# EAGLE design non_inverting_amplifier_2 (EAGLE 9.3.2)
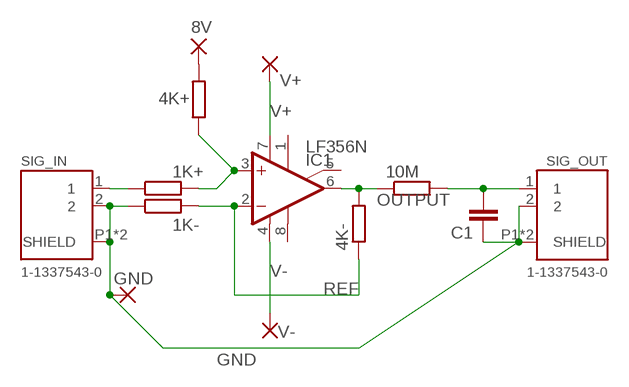
[diagram p0: schematic, sheet 1]

## Parts
1K+  R-EU_0207/12  [0207/12]
1K-  R-EU_0207/12  [0207/12]
4K+  R-EU_0207/12  [0207/12]
4K-  R-EU_0207/12  [0207/12]
8V  2,54/1,1  [2,54/1,1]
10M  R-EU_0207/12  [0207/12]
C1  C2,5-3  [C2.5-3]
GND  2,54/1,1  [2,54/1,1]
IC1  LF356N  [DIL08]
SIG_IN  1-1337543-0  [CONN_1-1337543-0]
SIG_OUT  1-1337543-0  [CONN_1-1337543-0]
V+  2,54/1,1  [2,54/1,1]
V-  2,54/1,1  [2,54/1,1]

## Nets
GND: 1K-.1 C1.1 GND.1(P) SIG_IN.2 SIG_IN.P1(SHIELD) SIG_IN.P2(SHIELD) SIG_OUT.2 SIG_OUT.P1(SHIELD) SIG_OUT.P2(SHIELD)
N$1: 1K+.1 SIG_IN.1
N$2: 1K+.2 4K+.1 IC1.3(+IN)
N$3: 4K+.2 8V.1(P)
N$4: 10M.2 C1.2 SIG_OUT.1
OUTPUT: 4K-.2 10M.1 IC1.6(OUT)
REF: 1K-.2 4K-.1 IC1.2(-IN)
V+: IC1.7(V+) V+.1(P)
V-: IC1.4(V-) V-.1(P)
Unconnected: IC1.1(ON1) IC1.5(ON2) IC1.8(OPT)

## Library data of the parts
1K+ 1K- 4K+ 4K- 10M = rcl:R-EU_: RESISTOR, European symbol; SPICEPREFIX: R
8V GND V+ V- = wirepad:2,54/1,1: THROUGH-HOLE PAD
C1 = capacitor-wima:C: CAPACITOR naming: grid - package width
IC1 = linear:LF356: OP AMP
SIG_IN SIG_OUT = jayich_lab_eagle_library:1-1337543-0: BNC appliance socket, right angle [TE Connectivity] 1-1337543-0 BNC appliance socket, right angle; COMMENT: 1-1337543-0; DESCRIPTION: BNC Ins R/A PCB Skt 50Ohm White; DIGI-KEY_PART_NUMBER: A97553-ND; DIGI-KEY_PURCHASE_URL: https://www.digikey.com/product-detail/en/te-connectivity-amp-connectors/1-1337543-0/A97553-ND/1755940?utm_source=snapeda&utm_medium=aggregator&utm_campaign=symbol; MF: TE Connectivity; MP: 1-1337543-0; NUMBER_OF_POSITIONS: 1; PACKAGE: None; TE_PURCHASE_URL: https://www.te.com/usa-en/product-1-1337543-0.html?te_bu=Cor&te_type=disp&te_campaign=seda_glo_cor-seda-global-disp-prtnr-fy19-seda-model-bom-cta_sma-317_1&elqCampaignId=32493

## Board
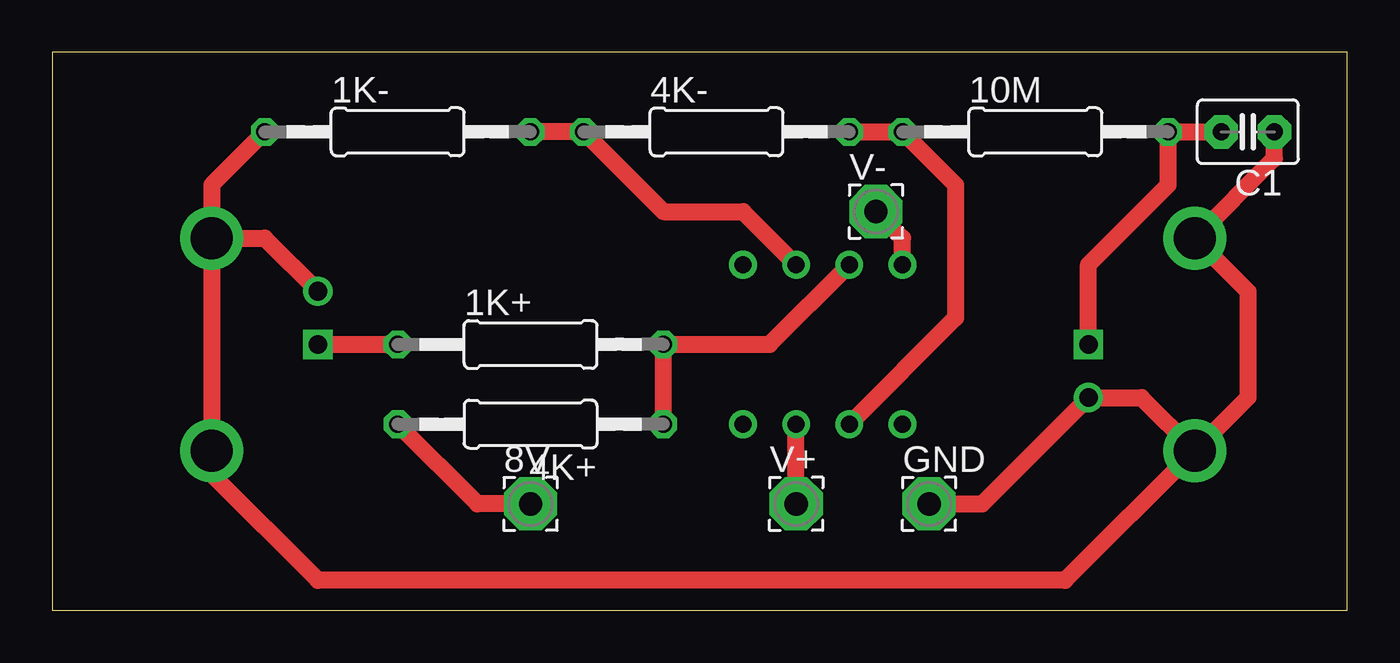
[diagram p1: board, top side]
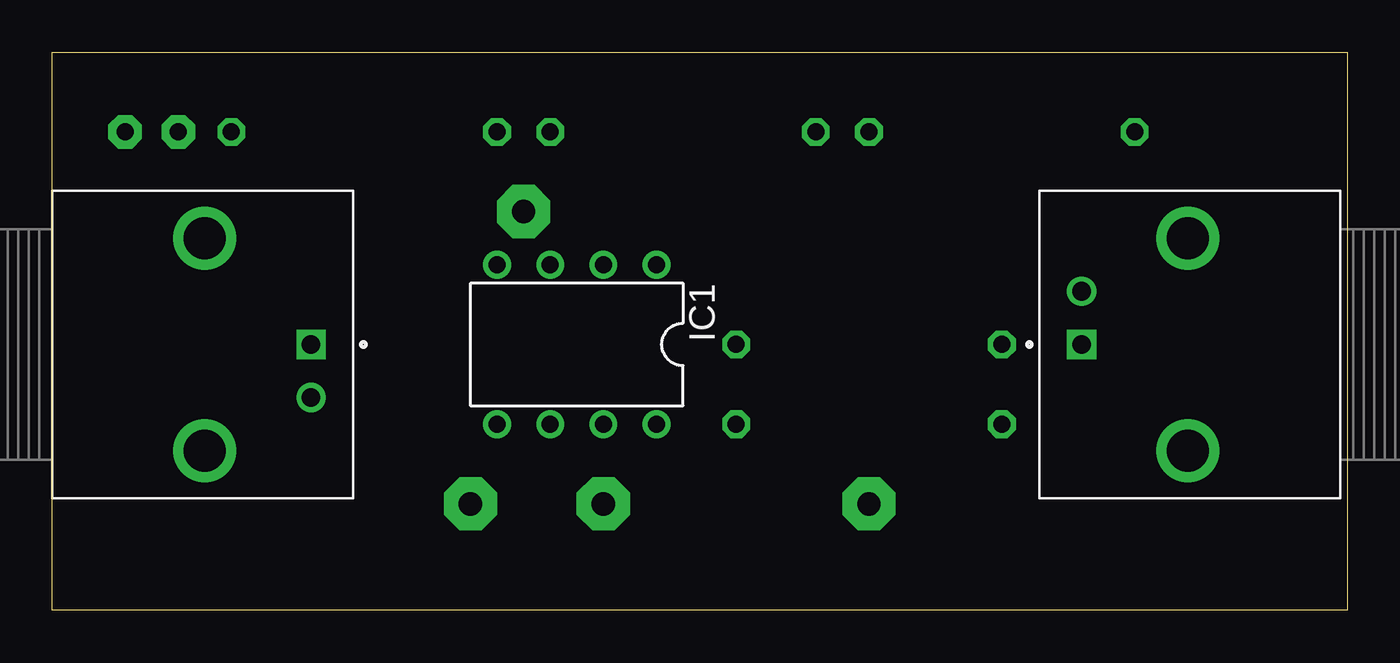
[diagram p2: board, bottom side, seen from below]

Size 61.9 x 26.66 mm. Coordinates in mm from the lower left corner, seen from the top.
Outline: 0,0 61.9,0 61.9,26.66 0,26.66 0,0
Copper layers (1*16): Top 0.035mm / dielectric 1.5mm / Bottom 0.035mm
Design rules "default": minimum track width 6mil, minimum drill 0.35mm, track to track 6mil, track to pad 6mil, pad to pad 6mil, via to via 6mil, smd to smd 6mil, copper to edge 40mil, drill to drill 6mil, minimum pad ring 10mil, minimum via ring 8mil, stop-mask expansion 4mil, vias tented up to drill 0mil, thermal gap 10mil

### Footprints (pad centres in the part's own frame; a part is rotated, then mirrored left to right if it is on the bottom)
0207/12 = drill 0.813 octagon: 1 -6.35,0; 2 6.35,0
2,54/1,1 = drill 1.118 pad 2.54 octagon: 1 0,0
C2.5-3 = drill 0.813 pad 1.6 octagon: 1 -1.27,0; 2 1.27,0
DIL08 = drill 0.813 pad 1.27: 1 -3.81,-3.81; 2 -1.27,-3.81; 3 1.27,-3.81; 4 3.81,-3.81; 5 3.81,3.81; 6 1.27,3.81; 7 -1.27,3.81; 8 -3.81,3.81
CONN_1-1337543-0 = drill 0.89 square: 1 0,0 | drill 0.89: 2 0,-2.54 | drill 2.01: P1 -5.08,-5.08; P2 -5.08,5.08

### Placement (x,y rotation side)
1K+  22.86,12.7 0 top
1K-  16.51,22.86 0 top
4K+  22.86,8.89 180 top
4K-  31.75,22.86 0 top
8V  22.86,5.08 0 top
10M  46.99,22.86 0 top
C1  57.15,22.86 180 top
GND  41.91,5.08 0 top
IC1  36.83,12.7 180 bottom
SIG_IN  12.7,12.7 180 bottom
SIG_OUT  49.53,12.7 0 bottom
V+  35.56,5.08 180 top
V-  39.37,19.05 0 top

### Tracks (layer width: path | path; a pad name or v marks a point on that pad's centre or on a via)
GND
  Top 0.813: SIG_IN.P1 SIG_IN.P2 7.62,6.5 12.7,1.42 48.41,1.42 SIG_OUT.P1 | SIG_IN.P1 10.16,17.78 SIG_IN.2 | SIG_OUT.P1 57.15,10.16 57.15,15.24 SIG_OUT.P2 58.42,21.59 C1.1 | 1K-.1 7.62,20.32 SIG_IN.P1 | GND.1 44.45,5.08 SIG_OUT.2 52.07,10.16 SIG_OUT.P1
N$1
  Top 0.813: SIG_IN.1 1K+.1
N$2
  Top 0.813: IC1.3 34.29,12.7 1K+.2 4K+.1
N$3
  Top 0.813: 8V.1 20.32,5.08 4K+.2
N$4
  Top 0.813: C1.2 10M.2 53.34,20.32 49.53,16.51 SIG_OUT.1
OUTPUT
  Top 0.813: 4K-.2 10M.1 43.18,20.32 43.18,13.97 IC1.6
REF
  Top 0.813: 1K-.2 4K-.1 29.21,19.05 33.02,19.05 IC1.2
V+
  Top 0.813: V+.1 IC1.7
V-
  Top 0.813: IC1.4 40.64,17.78 V-.1